# EAGLE schematic large (EAGLE 8.4.1)
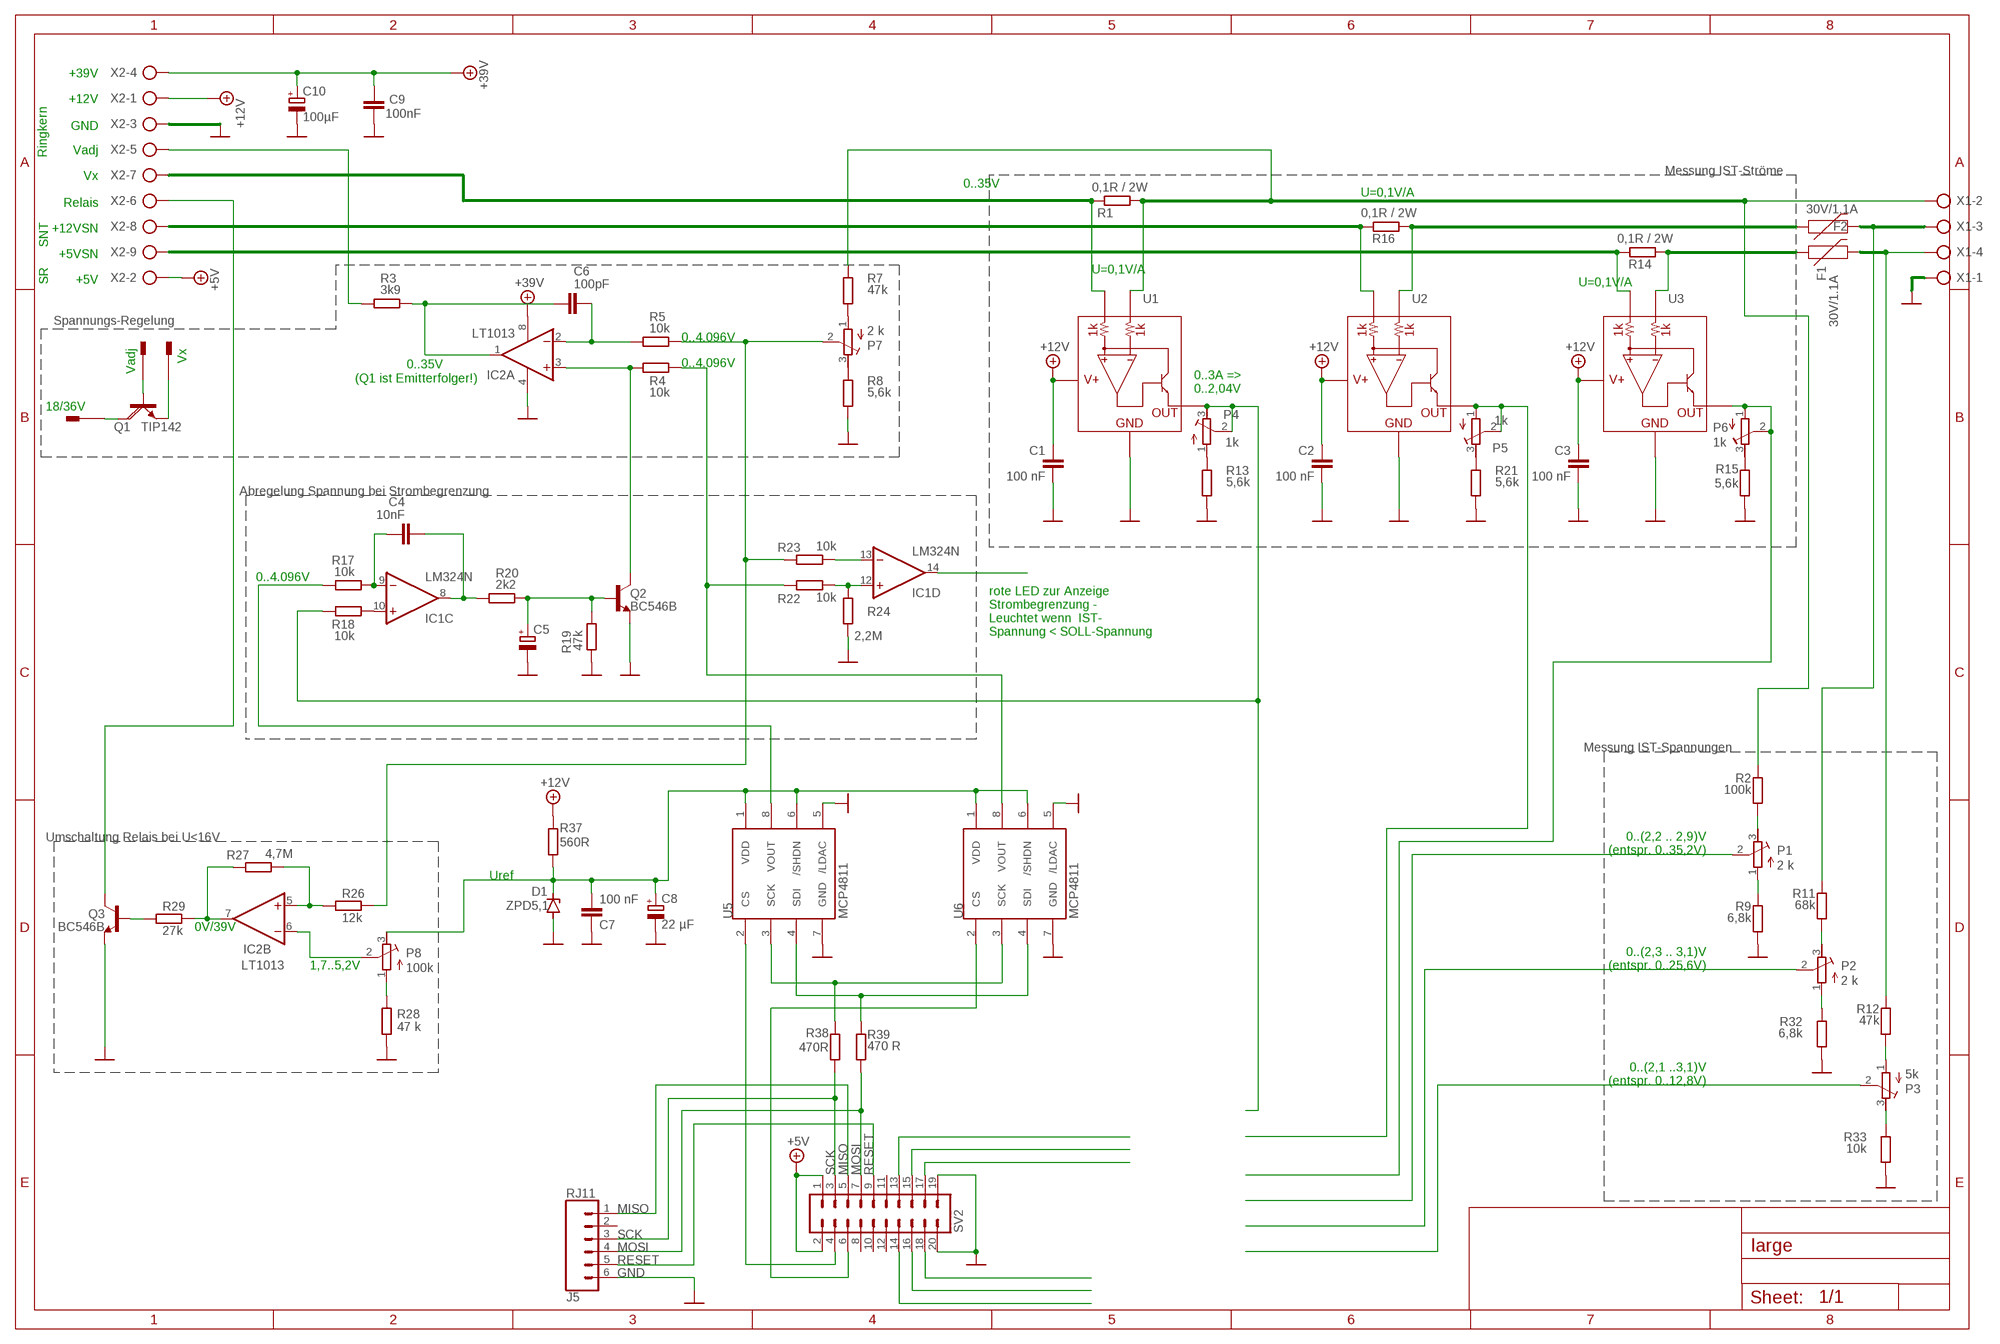
[diagram p0: schematic, sheet 1]

## Parts
C1  100 nF  C-EU025-025X050  [C025-025X050]
C2  100 nF  C-EU025-025X050  [C025-025X050]
C3  100 nF  C-EU025-025X050  [C025-025X050]
C4  10nF  C-EU025-025X050  [C025-025X050]
C5  CPOL-EUE2-4  [E2-4]
C6  100pF  C-EU025-025X050  [C025-025X050]
C7  100 nF  C-EU025-025X050  [C025-025X050]
C8  22 µF  CPOL-EUE2-5  [E2-5]
C9  100nF  C-EU025-025X050  [C025-025X050]
C10  100µF  CPOL-EUE2-5  [E2-5]
D1  ZPD5,1  ZENER-DIODEZD-5  [ZDIO-5]
F1  30V/1.1A  PPTC_PTH  [PTH]
F2  30V/1.1A  PPTC_PTH  [PTH]
IC1  LM324N  [DIL14]
IC2  LT1013  OPA1013P  [DIL08]
J2  PIN1-2  [62221]
J3  PIN1-2  [62221]
J4  PIN1-2  [62221]
J5  RJ11  RJ11-6  [RJ11-6]
P1  2 k  R-TRIMM64Y  [RTRIM64Y]
P2  2 k  R-TRIMM64Y  [RTRIM64Y]
P3  5k  R-TRIMM64Y  [RTRIM64Y]
P4  1k  R-TRIMM64Z  [RTRIM64Z]
P5  1k  R-TRIMM64Y  [RTRIM64Y]
P6  1k  R-TRIMM64Y  [RTRIM64Y]
P7  2 k  R-TRIMM64Y  [RTRIM64Y]
P8  100k  R-TRIMM64Z  [RTRIM64Z]
Q1  TIP142  [SOT93]
Q2  BC546B  BC546A  [TO92-EBC]
Q3  BC546B  BC546A  [TO92-EBC]
R1  0,1R / 2W  R-EU_0617/17  [0617/17]
R2  100k  R-EU_0204/7  [0204/7]
R3  3k9  R-EU_0204/7  [0204/7]
R4  10k  R-EU_0204/7  [0204/7]
R5  10k  R-EU_0204/7  [0204/7]
R7  47k  R-EU_0204/7  [0204/7]
R8  5,6k  R-EU_0204/7  [0204/7]
R9  6,8k  R-EU_0204/7  [0204/7]
R11  68k  R-EU_0204/7  [0204/7]
R12  47k  R-EU_0204/7  [0204/7]
R13  5,6k  R-EU_0204/7  [0204/7]
R14  0,1R / 2W  R-EU_0617/17  [0617/17]
R15  5,6k  R-EU_0204/5  [0204/5]
R16  0,1R / 2W  R-EU_0617/17  [0617/17]
R17  10k  R-EU_0204/5  [0204/5]
R18  10k  R-EU_0204/5  [0204/5]
R19  47k  R-EU_0204/5  [0204/5]
R20  2k2  R-EU_0204/5  [0204/5]
R21  5,6k  R-EU_0204/7  [0204/7]
R22  10k  R-EU_0204/5  [0204/5]
R23  10k  R-EU_0204/5  [0204/5]
R24  2,2M  R-EU_0204/5  [0204/5]
R26  12k  R-EU_0204/5  [0204/5]
R27  4,7M  R-EU_0204/5  [0204/5]
R28  47 k  R-EU_0204/5  [0204/5]
R29  27k  R-EU_0204/7  [0204/7]
R32  6,8k  R-EU_0204/7  [0204/7]
R33  10k  R-EU_0204/7  [0204/7]
R37  560R  R-EU_0204/7  [0204/7]
R38  470R  R-EU_0204/7  [0204/7]
R39  470 R  R-EU_0204/7  [0204/7]
SV2  MA10-2  [MA10-2]
U1  INA139DIL06  [DIL06]
U2  INA139DIL06  [DIL06]
U3  INA139DIL06  [DIL06]
U5  MCP4811  [PDIP8]
U6  MCP4811  [PDIP8]
X1  AK500/4  [AK500/4]
X2  AK500/9  [AK500/9]

## Nets
+5V: SV2.1 SV2.2 X2.2
+12V: C1.2 C2.2 C3.2 R37.1 U1.6(V+) U2.6(V+) U3.6(V+) X2.1
+24V: C9.2 C10.+ IC2.8(P:V+) X2.4 ; supply symbol labelled +39V
E$1: J2.1 Q1.C
E$2: J3.1 Q1.B
E$3: J4.1 Q1.E
GND: C1.1 C2.1 C3.1 C5.- C7.2 C8.- C9.1 C10.- D1.A IC2.4(P:V-) J5.6 Q2.E Q3.E R8.1 R9.1 R13.1 R15.1 R19.2 R21.1 R24.1 R28.1 R32.1 R33.1 SV2.19 SV2.20 U1.2(GND) U2.2(GND) U3.2(GND) U5.5(/LDAC) U5.7(GND) U6.5(/LDAC) U6.7(GND) X1.1 X2.3
MISO: J5.1 SV2.5
MOSI: J5.4 R39.1 SV2.7
N$1: P1.1(A) R9.2
N$2: R1.1 R2.2 R7.2 U1.4(VIN-) X1.2
N$3: P4.2(S) P4.3(E) R18.2 U1.1(OUT)
N$4: IC1.10(C:+IN) R18.1
N$5: P6.3(E) R15.2
N$6: F2.P$1 R16.1 U2.4(VIN-)
N$7: SV2.18
N$8: P1.3(E) R2.1
N$9: C5.+ Q2.B R19.1 R20.2
N$10: R4.2 R22.1 U6.8(VOUT)
N$11: R3.1 X2.5
N$12: IC1.12(D:+IN) R22.2 R24.2
N$13: IC2.3(A:+IN) Q2.C R4.1
N$14: C6.2 IC2.2(A:-IN) R5.1
N$15: R1.2 U1.3(VIN+) X2.7
N$16: P7.1(A) R7.1
N$17: P7.3(E) R8.2
N$18: R14.2 U3.3(VIN+) X2.9
N$19: P7.2(S) R5.2 R23.1 R26.2
N$20: F1.P$2 R12.2 X1.4
N$21: IC1.13(D:-IN) R23.2
N$22: P1.2(S)
N$23: P5.3(E) R21.2
N$24: SV2.16
N$25: SV2.14
N$26: R16.2 U2.3(VIN+) X2.8
N$27: F2.P$2 R11.2 X1.3
N$28: P5.1(A) P5.2(S) U2.1(OUT)
N$29: IC1.14(D:OUT)
N$30: C4.2 IC1.9(C:-IN) R17.1
N$31: F1.P$1 R14.1 U3.4(VIN-)
N$32: R17.2 U5.8(VOUT)
N$33: C4.1 IC1.8(C:OUT) R20.1
N$34: P8.1(A) R28.2
N$35: IC2.7(B:OUT) R27.1 R29.2
N$36: IC2.5(B:+IN) R26.1 R27.2
N$37: C6.1 IC2.1(A:OUT) R3.2
N$38: P6.1(A) P6.2(S) U3.1(OUT)
N$39: Q3.B R29.1
N$40: Q3.C X2.6
N$41: SV2.4 U5.2(CS)
N$42: IC2.6(B:-IN) P8.2(S)
N$43: SV2.17
N$44: SV2.15
N$45: R38.2 U5.3(SCK) U6.3(SCK)
N$46: SV2.13
N$47: R39.2 U5.4(SDI) U6.4(SDI)
N$48: P4.1(A) R13.2
N$49: P3.1(A) R12.1
N$50: P2.2(S)
N$51: P3.2(S)
N$52: P3.3(E) R33.2
N$53: P2.3(E) R11.1
N$56: P2.1(A) R32.2
N$58: C7.1 C8.+ D1.C P8.3(E) R37.2 U5.1(VDD) U5.6(/SHDN) U6.1(VDD) U6.6(/SHDN)
PB3: SV2.6 U6.2(CS)
RESET: J5.5 SV2.9
SCK: J5.3 R38.1 SV2.3
Unconnected: IC1.1(A:OUT) IC1.2(A:-IN) IC1.3(A:+IN) IC1.5(B:+IN) IC1.6(B:-IN) IC1.7(B:OUT) J5.2 SV2.8 SV2.10 SV2.11 SV2.12

## Notes on the sheet
- +39V
- +12V
- GND
- Vadj
- Ringkern
- Vx
- Messung IST-Ströme
- 0..35V | U=0,1V/A
- Relais
- +12VSN
- SNT | +5VSN
- U=0,1V/A
- +5V | U=0,1V/A
- SR
- Spannungs-Regelung
- 0..4.096V
- Vadj | Vx
- 0..35V
- 0..4.096V
- (Q1 ist Emitterfolger!)
- 0..3A => 
  0..2,04V
- 18/36V
- Abregelung Spannung bei Strombegrenzung
- 0..4.096V
- rote LED zur Anzeige 
  Strombegrenzung -
  Leuchtet wenn  IST-
  Spannung < SOLL-Spannung
- Messung IST-Spannungen
- Umschaltung Relais bei U<16V
- 0..(2,2 .. 2,9)V
  (entspr. 0..35,2V)
- Uref
- 0V/39V
- 1,7..5,2V
- 0..(2,3 .. 3,1)V
  (entspr. 0..25,6V)
- 0..(2,1 ..3,1)V
  (entspr. 0..12,8V)

## Power pins joined to a net without a drawn wire
V+: IC1.4(P:V+)
V-: IC1.11(P:V-)

## Library data of the parts
C1-C4 C6 C7 C9 = rcl:C-EU: CAPACITOR, European symbol
C5 C8 C10 = rcl:CPOL-EU: POLARIZED CAPACITOR, European symbol
D1 = diode:ZENER-DIODE: Z-Diode
F1 F2 = SparkFun-Fuses:PPTC: Resettable Fuse PPTC Resettable Fuse. Really a sort of resistor with a polymeric positive temperature coefficient whose resistance increases dramatically with an increase in temperature. When heated by the power passing through the resistance rises causing the current to be limited, protecting the circuit. This is achieved by the transition of the polymer from a crystalline to an amorphous state where the conductive carbon separates breaking the conductive pathways found in the cool crystalline structure. When a PPTC cools back down it resumes conducting letting the circuit turn back on. SparkFun Products: SparkFun RedBoard - Programmed with Arduino <https://www.sparkfun.com/products/12757> Pro Micro - 5V/16MHz <https://www.sparkfun.com/products/12640> Arduino Pro 328 - 5V/16MHz <https://www.sparkfun.com/products/10915> MP3 Trigger <https://www.sparkfun.com/products/13720>; PROD_ID: RES-08490; VALUE: 72V/0.25A
IC1 = linear:LM324: OP AMP
IC2 = linear:OPA1013: OP AMP
J2-J4 = con-faston:PIN1-2: CONN TAB FASTON BRASS .187 PCB TAB, FSSTON, DUAL STAKE, .187 SERIES Digi-Key Part Number: A24734CT-ND Source: Tyco Electronics Corporation .. ENG_CD_62221_R.pdf http://search.digikey.com/scripts/DkSearch/dksus.dll?Detail&name=A24734CT-ND; MF: TYCO ELECTRONICS; MPN: 62221-1; OC_FARNELL: unknown; OC_NEWARK: 16H2318
J5 = SparkFun-Connectors:RJ11-6: RJ11 Jack - 6 pin Commonly found on CAT3 devices and some Microchip programmers. Here is the connector we sell at SparkFun: RJ11 6-Pin Connector <https://www.sparkfun.com/products/132> (PRT-00132) Datasheet <http://www.sparkfun.com/datasheets/Prototyping/Connectors/RJ11-Datasheet.pdf> It is used on this SparkFun product: SparkFun Weather Shield <https://www.sparkfun.com/products/12081> (DEV-12081) Weather Meters <https://www.sparkfun.com/products/8942> (SEN-08942); PROD_ID: CONN-08590; SF_ID: PRT-00132
P1-P8 = rcl:R-TRIMM: Trimm resistor
Q1 = transistor-power:TIP142: NPN DARLINGTON TRANSISTOR
Q2 Q3 = transistor-npn:BC546*: NPN Transistor
R1-R5 R7-R9 R11-R24 R26-R29 R32 R33 R37-R39 = rcl:R-EU_: RESISTOR, European symbol
SV2 = con-lstb:MA10-2: PIN HEADER; OC_FARNELL: unknown; OC_NEWARK: unknown
U1-U3 = cnc:INA139: High-side shunt current sense 2.7V-40V, 1% Prototype: IC-11211
U5 U6 = cnc:MCP4811
X1 = con-ptr500:AK500/4: CONNECTOR; OC_FARNELL: unknown; OC_NEWARK: unknown
X2 = con-ptr500:AK500/9: CONNECTOR; OC_FARNELL: unknown; OC_NEWARK: unknown